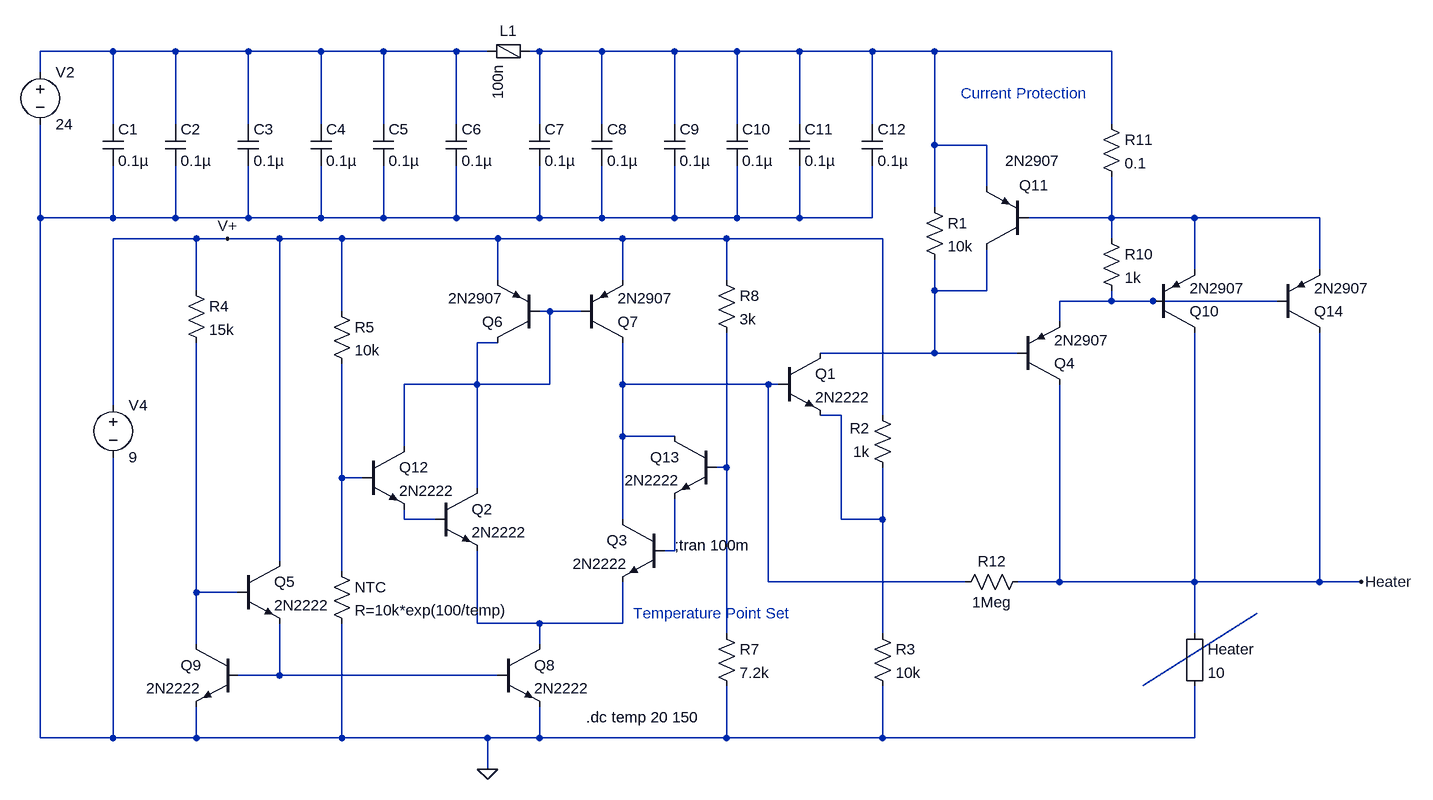
[diagram p0: schematic TransistorAnalogHeater.asc]
TransistorAnalogHeater.asc, the LTspice schematic file:
Version 4
SHEET 1 2552 1284
WIRE -1056 -416 -1168 -416
WIRE -960 -416 -1056 -416
WIRE -848 -416 -960 -416
WIRE -736 -416 -848 -416
WIRE -640 -416 -736 -416
WIRE -528 -416 -640 -416
WIRE -480 -416 -528 -416
WIRE -400 -416 -416 -416
WIRE -304 -416 -400 -416
WIRE -192 -416 -304 -416
WIRE -96 -416 -192 -416
WIRE 0 -416 -96 -416
WIRE 112 -416 0 -416
WIRE 208 -416 112 -416
WIRE 480 -416 208 -416
WIRE -1168 -384 -1168 -416
WIRE -1056 -304 -1056 -416
WIRE -960 -304 -960 -416
WIRE -848 -304 -848 -416
WIRE -736 -304 -736 -416
WIRE -640 -304 -640 -416
WIRE -528 -304 -528 -416
WIRE -400 -304 -400 -416
WIRE -304 -304 -304 -416
WIRE -192 -304 -192 -416
WIRE -96 -304 -96 -416
WIRE 0 -304 0 -416
WIRE 112 -304 112 -416
WIRE 480 -304 480 -416
WIRE 208 -272 208 -416
WIRE 288 -272 208 -272
WIRE 288 -208 288 -272
WIRE 208 -176 208 -272
WIRE -1168 -160 -1168 -304
WIRE -1056 -160 -1056 -240
WIRE -1056 -160 -1168 -160
WIRE -960 -160 -960 -240
WIRE -960 -160 -1056 -160
WIRE -848 -160 -848 -240
WIRE -848 -160 -960 -160
WIRE -736 -160 -736 -240
WIRE -736 -160 -848 -160
WIRE -640 -160 -640 -240
WIRE -640 -160 -736 -160
WIRE -528 -160 -528 -240
WIRE -528 -160 -640 -160
WIRE -400 -160 -400 -240
WIRE -400 -160 -528 -160
WIRE -304 -160 -304 -240
WIRE -304 -160 -400 -160
WIRE -192 -160 -192 -240
WIRE -192 -160 -304 -160
WIRE -96 -160 -96 -240
WIRE -96 -160 -192 -160
WIRE 0 -160 0 -240
WIRE 0 -160 -96 -160
WIRE 112 -160 112 -240
WIRE 112 -160 0 -160
WIRE 480 -160 480 -224
WIRE 480 -160 352 -160
WIRE 608 -160 480 -160
WIRE 800 -160 608 -160
WIRE -928 -128 -1056 -128
WIRE -880 -128 -928 -128
WIRE -800 -128 -880 -128
WIRE -704 -128 -800 -128
WIRE -464 -128 -704 -128
WIRE -272 -128 -464 -128
WIRE -112 -128 -272 -128
WIRE 128 -128 -112 -128
WIRE 480 -128 480 -160
WIRE 608 -80 608 -160
WIRE 800 -80 800 -160
WIRE -464 -64 -464 -128
WIRE -272 -64 -272 -128
WIRE -112 -64 -112 -128
WIRE -928 -48 -928 -128
WIRE 208 -48 208 -96
WIRE 288 -48 288 -112
WIRE 288 -48 208 -48
WIRE 480 -32 480 -48
WIRE 480 -32 400 -32
WIRE 544 -32 480 -32
WIRE 736 -32 544 -32
WIRE -704 -16 -704 -128
WIRE -384 -16 -400 -16
WIRE -336 -16 -384 -16
WIRE 400 0 400 -32
WIRE -464 32 -496 32
WIRE 208 48 208 -48
WIRE 208 48 32 48
WIRE 336 48 208 48
WIRE -496 96 -496 32
WIRE -496 96 -608 96
WIRE -384 96 -384 -16
WIRE -384 96 -496 96
WIRE -272 96 -272 32
WIRE -48 96 -272 96
WIRE -32 96 -48 96
WIRE -1056 128 -1056 -128
WIRE 64 144 32 144
WIRE 128 144 128 -128
WIRE -272 176 -272 96
WIRE -192 176 -272 176
WIRE -608 192 -608 96
WIRE -112 224 -112 16
WIRE -112 224 -128 224
WIRE -704 240 -704 64
WIRE -672 240 -704 240
WIRE -496 256 -496 96
WIRE -608 304 -608 288
WIRE -560 304 -608 304
WIRE -272 304 -272 176
WIRE 64 304 64 144
WIRE 128 304 128 224
WIRE 128 304 64 304
WIRE -192 352 -192 272
WIRE -192 352 -208 352
WIRE -800 368 -800 -128
WIRE -704 384 -704 240
WIRE -48 400 -48 96
WIRE 256 400 -48 400
WIRE 400 400 400 96
WIRE 400 400 336 400
WIRE 608 400 608 16
WIRE 608 400 400 400
WIRE 800 400 800 16
WIRE 800 400 608 400
WIRE 864 400 800 400
WIRE -928 416 -928 32
WIRE -864 416 -928 416
WIRE -496 464 -496 352
WIRE -400 464 -496 464
WIRE -272 464 -272 400
WIRE -272 464 -400 464
WIRE -112 480 -112 224
WIRE 128 480 128 304
WIRE 608 480 608 400
WIRE -928 496 -928 416
WIRE -400 496 -400 464
WIRE -800 544 -800 464
WIRE -800 544 -864 544
WIRE -464 544 -800 544
WIRE 528 560 704 448
WIRE -1168 640 -1168 -160
WIRE -1056 640 -1056 208
WIRE -1056 640 -1168 640
WIRE -928 640 -928 592
WIRE -928 640 -1056 640
WIRE -704 640 -704 464
WIRE -704 640 -928 640
WIRE -480 640 -704 640
WIRE -400 640 -400 592
WIRE -400 640 -480 640
WIRE -112 640 -112 560
WIRE -112 640 -400 640
WIRE 128 640 128 560
WIRE 128 640 -112 640
WIRE 608 640 608 560
WIRE 608 640 128 640
WIRE -480 688 -480 640
FLAG -880 -128 V+
FLAG -480 688 0
FLAG 864 400 Heater
SYMBOL npn -32 48 R0
SYMATTR InstName Q1
SYMATTR Value 2N2222
SYMBOL res 192 -192 R0
SYMATTR InstName R1
SYMATTR Value 10k
SYMBOL voltage -1168 -400 R0
SYMATTR InstName V2
SYMATTR Value 24
SYMBOL res 144 240 R180
WINDOW 0 36 76 Left 2
WINDOW 3 36 40 Left 2
SYMATTR InstName R2
SYMATTR Value 1k
SYMBOL res 112 464 R0
SYMATTR InstName R3
SYMATTR Value 10k
SYMBOL npn -560 256 R0
SYMATTR InstName Q2
SYMATTR Value 2N2222
SYMBOL npn -208 304 M0
SYMATTR InstName Q3
SYMATTR Value 2N2222
SYMBOL voltage -1056 112 R0
SYMATTR InstName V4
SYMATTR Value 9
SYMBOL res -944 -64 R0
SYMATTR InstName R4
SYMATTR Value 15k
SYMBOL pnp -400 32 R180
SYMATTR InstName Q6
SYMATTR Value 2N2907
SYMBOL pnp -336 32 M180
SYMATTR InstName Q7
SYMATTR Value 2N2907
SYMBOL npn -464 496 R0
SYMATTR InstName Q8
SYMATTR Value 2N2222
SYMBOL npn -864 496 M0
SYMATTR InstName Q9
SYMATTR Value 2N2222
SYMBOL npn -864 368 R0
SYMATTR InstName Q5
SYMATTR Value 2N2222
SYMBOL res -720 -32 R0
SYMATTR InstName R5
SYMATTR Value 10k
SYMBOL res -720 368 R0
SYMATTR InstName NTC
SYMATTR Value R=10k*exp(100/temp)
SYMBOL res -128 464 R0
SYMATTR InstName R7
SYMATTR Value 7.2k
SYMBOL res -128 -80 R0
SYMATTR InstName R8
SYMATTR Value 3k
SYMBOL pnp 336 96 M180
SYMATTR InstName Q4
SYMATTR Value 2N2907
SYMBOL pnp 544 16 M180
SYMATTR InstName Q10
SYMATTR Value 2N2907
SYMBOL Misc\\EuropeanResistor 592 464 R0
SYMATTR InstName Heater
SYMATTR Value 10
SYMBOL res 464 -144 R0
SYMATTR InstName R10
SYMATTR Value 1k
SYMBOL res 464 -320 R0
SYMATTR InstName R11
SYMATTR Value 0.1
SYMBOL pnp 352 -112 R180
WINDOW 0 -32 98 Left 2
WINDOW 3 -49 136 Left 2
SYMATTR InstName Q11
SYMATTR Value 2N2907
SYMBOL res 352 384 R90
WINDOW 0 0 56 VBottom 2
WINDOW 3 32 56 VTop 2
SYMATTR InstName R12
SYMATTR Value 1Meg
SYMBOL npn -672 192 R0
SYMATTR InstName Q12
SYMATTR Value 2N2222
SYMBOL npn -128 176 M0
SYMATTR InstName Q13
SYMATTR Value 2N2222
SYMBOL cap -1072 -304 R0
SYMATTR InstName C1
SYMATTR Value 0.1µ
SYMBOL cap -976 -304 R0
SYMATTR InstName C2
SYMATTR Value 0.1µ
SYMBOL cap -864 -304 R0
SYMATTR InstName C3
SYMATTR Value 0.1µ
SYMBOL cap -752 -304 R0
SYMATTR InstName C4
SYMATTR Value 0.1µ
SYMBOL cap -656 -304 R0
SYMATTR InstName C5
SYMATTR Value 0.1µ
SYMBOL cap -544 -304 R0
SYMATTR InstName C6
SYMATTR Value 0.1µ
SYMBOL FerriteBead -448 -416 R90
WINDOW 0 -16 0 VBottom 2
SYMATTR InstName L1
SYMATTR Value 100n
SYMBOL cap -416 -304 R0
SYMATTR InstName C7
SYMATTR Value 0.1µ
SYMBOL cap -320 -304 R0
SYMATTR InstName C8
SYMATTR Value 0.1µ
SYMBOL cap -208 -304 R0
SYMATTR InstName C9
SYMATTR Value 0.1µ
SYMBOL cap -112 -304 R0
SYMATTR InstName C10
SYMATTR Value 0.1µ
SYMBOL cap -16 -304 R0
SYMATTR InstName C11
SYMATTR Value 0.1µ
SYMBOL cap 96 -304 R0
SYMATTR InstName C12
SYMATTR Value 0.1µ
SYMBOL pnp 736 16 M180
SYMATTR InstName Q14
SYMATTR Value 2N2907
TEXT -192 344 Left 2 !;tran 100m
TEXT -256 448 Left 2 ;Temperature Point Set
TEXT 248 -352 Left 2 ;Current Protection
TEXT -328 608 Left 2 !.dc temp 20 150

The netlist it stands for:
* TransistorAnalogHeater.asc
Q1 N004 N007 N008 0 2N2222
R1 N002 N004 10k
V2 N001 0 24
R2 N008 V+ 1k
R3 N008 0 10k
Q2 N006 N011 N014 0 2N2222
Q3 N007 N012 N014 0 2N2222
V4 V+ 0 9
R4 V+ N013 15k
Q6 N006 N006 V+ 0 2N2907
Q7 N007 N006 V+ 0 2N2907
Q8 N014 N015 0 0 2N2222
Q9 N013 N015 0 0 2N2222
Q5 V+ N013 N015 0 2N2222
R5 V+ N010 10k
R§NTC N010 0 R=10k*exp(100/temp)
R7 N009 0 7.2k
R8 V+ N009 3k
Q4 Heater N004 N005 0 2N2907
Q10 Heater N005 N003 0 2N2907
R§Heater Heater 0 10
R10 N003 N005 1k
R11 N002 N003 0.1
Q11 N004 N003 N002 0 2N2907
R12 Heater N007 1Meg
Q12 N006 N010 N011 0 2N2222
Q13 N007 N009 N012 0 2N2222
C1 N001 0 0.1µ
C2 N001 0 0.1µ
C3 N001 0 0.1µ
C4 N001 0 0.1µ
C5 N001 0 0.1µ
C6 N001 0 0.1µ
L1 N002 N001 100n
C7 N002 0 0.1µ
C8 N002 0 0.1µ
C9 N002 0 0.1µ
C10 N002 0 0.1µ
C11 N002 0 0.1µ
C12 N002 0 0.1µ
Q14 Heater N005 N003 0 2N2907
.model NPN NPN
.model PNP PNP
.lib standard.bjt
;tran 100m
* Temperature Point Set
* Current Protection
.dc temp 20 150
.backanno
.end